# Altium schematic sheet Termistor Channel.SchDoc
size A
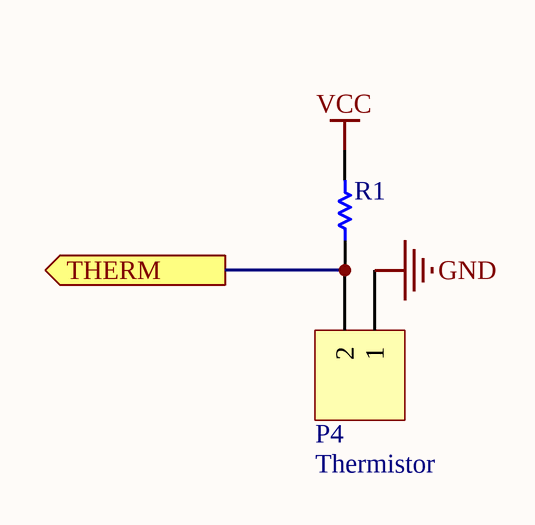
[diagram p0: Termistor Channel.SchDoc]

## Parts
P4  Thermistor  [HDR1X2]
R1  1K 5% 0603(1608)  [RESC0603(1608)_L]  (value not drawn)

## Ports
THERM (out)

## Nets
GND: P4.1
VCC: R1.2
THERM: P4.2 R1.1 ; port THERM

## Library data of the parts
P4 = Header 2: Header, 2-Pin; LatestRevisionDate: 17-Jul-2002; LatestRevisionNote: Re-released for DXP Platform.; Publisher: Altium Limited
R1 = CMP-1012-00074-1: 1K 0.1W 5% 0603 (1608 Metric)  SMD; Case-Metric: 1608; Value: 1000.00 Ohm; Case-EIA: 0603; Power: 0.1 W; Tolerance: 5 %; Technology: SMT